# Altium project PCB_Control.PrjPcb
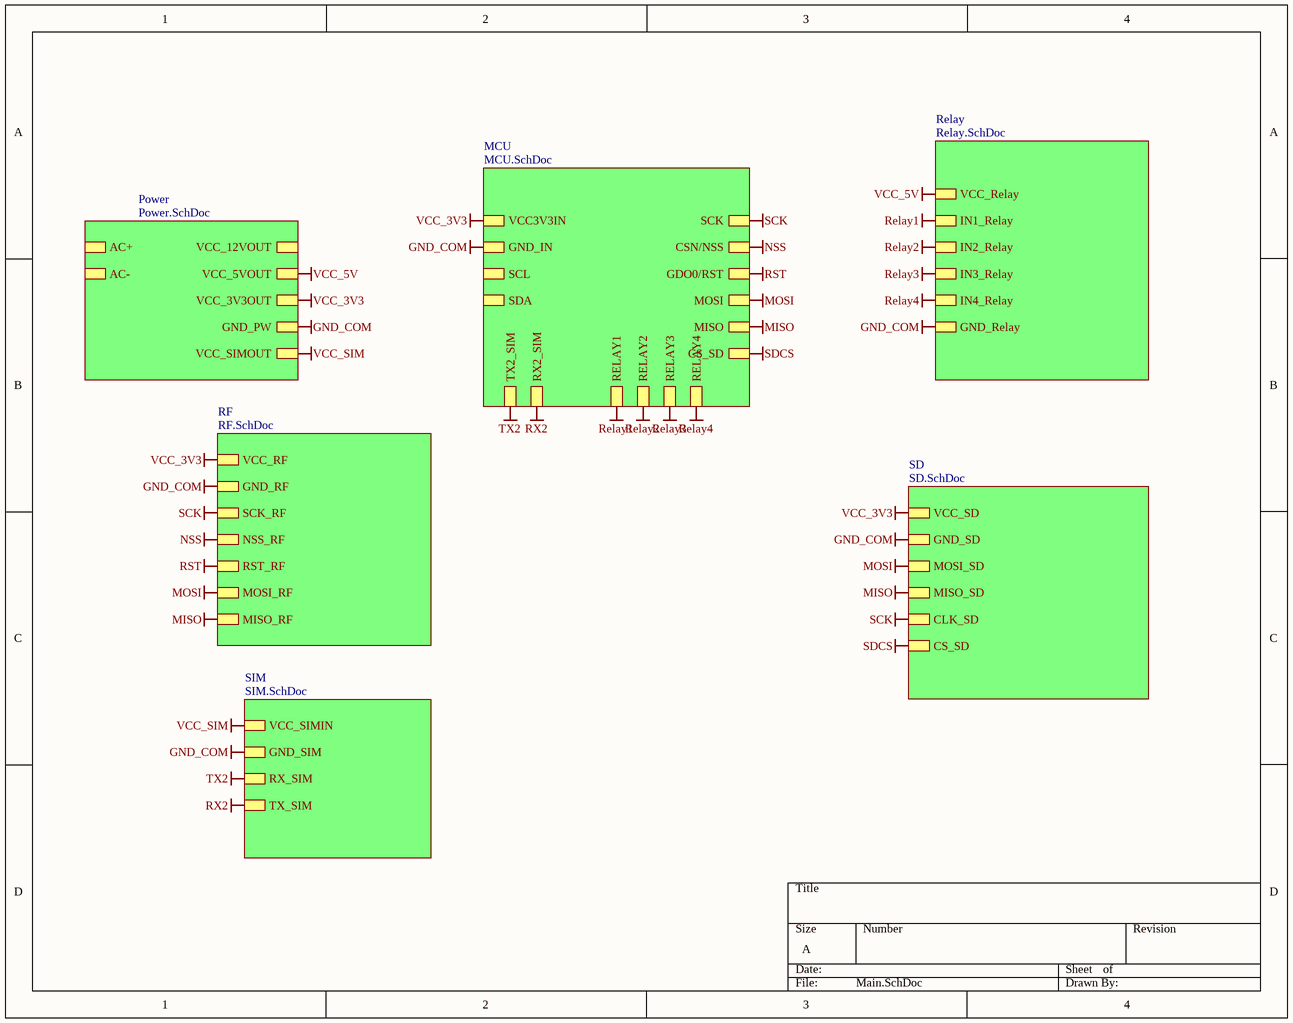
[diagram p0: Main.SchDoc]
7 sheets, 80 parts. Net scope: hierarchical (ports join the sheet entries above them; power ports are global).
Board files: Control.PcbDoc, PCB1.PcbDoc
Sheets:
  Main.SchDoc
    MCU = MCU.SchDoc
    Relay = Relay.SchDoc
    Power = Power.SchDoc
    SIM = SIM.SchDoc
    RF = RF.SchDoc
    SD = SD.SchDoc

## Sheet Main.SchDoc
size A; SheetNumber: 1; SheetTotal: 4

### Sub-sheets
MCU = MCU.SchDoc: TX2_SIM, RX2_SIM, SCK, CSN/NSS, GDO0/RST, MOSI, MISO, RELAY1, RELAY2, RELAY3, RELAY4, CS_SD, VCC3V3IN, GND_IN, SCL, SDA
Power = Power.SchDoc: VCC_12VOUT, VCC_5VOUT, VCC_3V3OUT, GND_PW, VCC_SIMOUT, AC+, AC-
Relay = Relay.SchDoc: VCC_Relay, IN1_Relay, IN2_Relay, IN3_Relay, IN4_Relay, GND_Relay
RF = RF.SchDoc: VCC_RF, GND_RF, SCK_RF, RST_RF, NSS_RF, MOSI_RF, MISO_RF
SD = SD.SchDoc: GND_SD, MOSI_SD, MISO_SD, CLK_SD, CS_SD, VCC_SD
SIM = SIM.SchDoc: VCC_SIMIN, GND_SIM, RX_SIM, TX_SIM

### Nets
GND_COM: sheet MCU/GND_IN, sheet Relay/GND_Relay, sheet Power/GND_PW, sheet SIM/GND_SIM, sheet RF/GND_RF, sheet SD/GND_SD  [project net GND]
MISO: sheet MCU/MISO, sheet RF/MISO_RF, sheet SD/MISO_SD
MOSI: sheet MCU/MOSI, sheet RF/MOSI_RF, sheet SD/MOSI_SD
NSS: sheet MCU/CSN/NSS, sheet RF/NSS_RF
Relay1: sheet MCU/RELAY1, sheet Relay/IN1_Relay  [project net IN1]
Relay2: sheet MCU/RELAY2, sheet Relay/IN2_Relay  [project net IN2]
Relay3: sheet MCU/RELAY3, sheet Relay/IN3_Relay  [project net IN3]
Relay4: sheet MCU/RELAY4, sheet Relay/IN4_Relay  [project net IN4]
RST: sheet MCU/GDO0/RST, sheet RF/RST_RF
RX2: sheet MCU/RX2_SIM, sheet SIM/TX_SIM
SCK: sheet MCU/SCK, sheet RF/SCK_RF, sheet SD/CLK_SD
SDCS: sheet MCU/CS_SD, sheet SD/CS_SD
TX2: sheet MCU/TX2_SIM, sheet SIM/RX_SIM
VCC_3V3: sheet MCU/VCC3V3IN, sheet Power/VCC_3V3OUT, sheet RF/VCC_RF, sheet SD/VCC_SD  [project net VCC_3V3PW]
VCC_5V: sheet Relay/VCC_Relay, sheet Power/VCC_5VOUT  [project net VCC]
VCC_SIM: sheet Power/VCC_SIMOUT, sheet SIM/VCC_SIMIN  [project net V_SIM_7V]

## Sheet MCU.SchDoc
size A; SheetNumber: 2; SheetTotal: 4
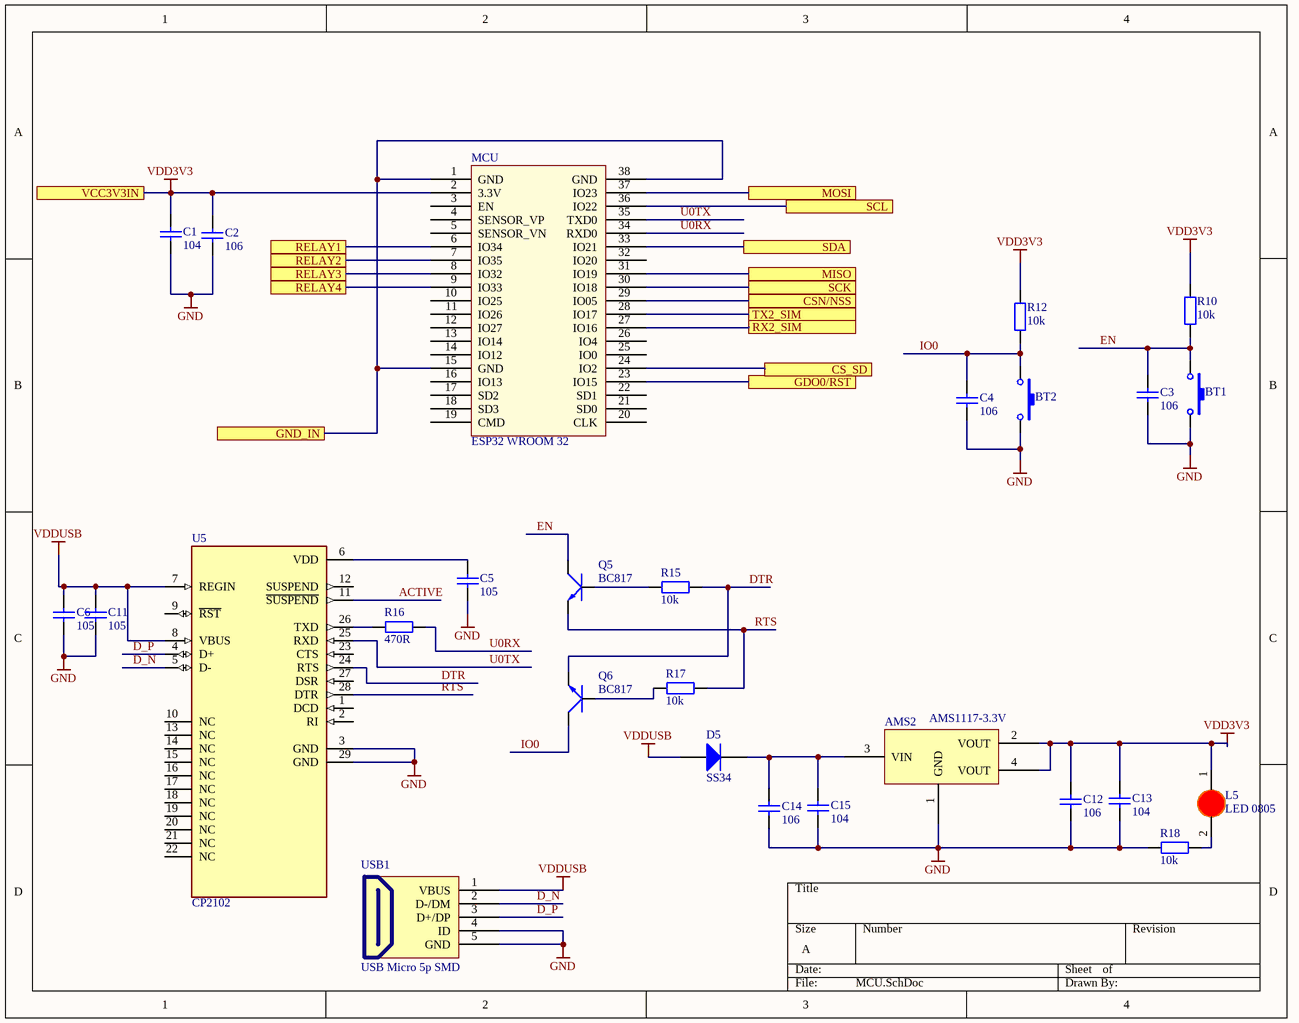
[diagram p1: MCU.SchDoc]

### Parts
AMS2  AMS1117-3.3V  [SOT223]
BT1  Nut Nhan 2 Chan SMD 3x6x2.5  [Nut Nhan 2 Chan SMD 3x6x2.5]  (value not drawn)
BT2  Nut Nhan 2 Chan SMD 3x6x2.5  [Nut Nhan 2 Chan SMD 3x6x2.5]  (value not drawn)
C1  104  [tu 0805]
C2  106  [tu 0805]
C3  106  [tu 0805]
C4  106  [tu 0805]
C5  105  [tu 0805]
C6  105  [tu 0805]
C11  105  [tu 0805]
C12  106  [tu 0805]
C13  104  [tu 0805]
C14  106  [tu 0805]
C15  104  [tu 0805]
D5  SS34  [DIODE SMA]
L5  LED 0805  [LED-0805-Red]
MCU  ESP32 WROOM 32  [ESP32-WROOM-32D]
Q5  BC817  [SOT-23]
Q6  BC817  [SOT-23]
R10  10k  [tro smd 0805]
R12  10k  [tro smd 0805]
R15  10k  [tro smd 0805]
R16  470R  [Tro SMD 0805]
R17  10k  [tro smd 0805]
R18  10k  [tro smd 0805]
U5  CP2102  [QFN50P500X500X100-29N]
USB1  USB Micro 5p SMD  [USB Micro 5p SMD]

### Ports
CS_SD, CSN/NSS, GDO0/RST, GND_IN, MISO, MOSI, RELAY1, RELAY2, RELAY3, RELAY4, RX2_SIM, SCK, SCL, SDA, TX2_SIM, VCC3V3IN

### Nets
GND: AMS2.1(GND) BT1.2 BT2.2 C1.2 C2.2 C3.2 C4.2 C5.2 C6.2 C11.2 C12.2 C13.2 C14.2 C15.2 MCU.1(GND) MCU.15(GND) MCU.38(GND) R18.2 U5.3(GND) U5.29(GND) USB1.4(ID) USB1.5(GND) ; port GND_IN
IN1: MCU.6(IO34) ; port RELAY1
IN2: MCU.7(IO35) ; port RELAY2
IN3: MCU.8(IO32) ; port RELAY3
IN4: MCU.9(IO33) ; port RELAY4
MISO: MCU.31(IO19) ; port MISO
MOSI: MCU.37(IO23) ; port MOSI
NSS: MCU.29(IO05) ; port CSN/NSS
RST: MCU.23(IO15) ; port GDO0/RST
RX2: MCU.27(IO16) ; port RX2_SIM
SCK: MCU.30(IO18) ; port SCK
SDCS: MCU.24(IO2) ; port CS_SD
TX2: MCU.28(IO17) ; port TX2_SIM
VDD3V3: AMS2.2(VOUT) AMS2.4(VOUT) C1.1 C2.1 C12.1 C13.1 L5.1(A) MCU.2(3.3V) R10.2 R12.2 ; port VCC3V3IN  [project net VCC_3V3PW]
VDDUSB: C6.1 C11.1 D5.1(A) U5.7(REGIN) U5.8(VBUS) USB1.1(VBUS)
ACTIVE: U5.11(~{SUSPEND})
D_N: U5.5(D-) USB1.2(D-/DM)
D_P: U5.4(D+) USB1.3(D+/DP)
DTR: Q6.2(E) R15.2 U5.24(RTS)
EN: BT1.1 C3.1 Q5.3(C) R10.1
IO0: BT2.1 C4.1 Q6.3(C) R12.1
RTS: Q5.2(E) R17.2 U5.28(DTR)
U0RX: MCU.34(RXD0) R16.2
U0TX: MCU.35(TXD0) U5.25(RXD)
NetAMS2_3: AMS2.3(VIN) C14.1 C15.1 D5.2(K)
NetC5_1: C5.1 U5.6(VDD)
NetL5_2: L5.2(K) R18.1
NetMCU_33: MCU.33(IO21) ; port SDA
NetMCU_36: MCU.36(IO22) ; port SCL
NetQ5_1: Q5.1(B) R15.1
NetQ6_1: Q6.1(B) R17.1
NetR16_1: R16.1 U5.26(TXD)

Not connected (* = marked no-connect by the designer): MCU 3(EN) 4(SENSOR_VP) 5(SENSOR_VN) 10(IO25) 11(IO26) 12(IO27) 13(IO14) 14(IO12) 16(IO13) 17(SD2) 18(SD3) 19(CMD) 20(CLK) 21(SD0) 22(SD1) 25(IO0) 26(IO4) 32(IO20); U5 1(DCD) 2(RI) 9(~{RST}) 10(NC) 12(SUSPEND) 13(NC) 14(NC) 15(NC) 16(NC) 17(NC) 18(NC) 19(NC) 20(NC) 21(NC) 22(NC) 23(CTS) 27(DSR)

### Library data of the parts
AMS2 = AMS1117 SMD: Dán; Value: AMS1117-3.3V SOT223; Don_Vi: Con; Ma_Hang: MH000596; Ghi_Chu: *; Kieu_Chan: *; Chung_Loai: Dán
BT1 BT2 = Nut Nhan 2 Chan SMD 3x6x2.5: Ma_Hang: MH001036; Ten: Nút Nhấn 2 Chân 3x6x2.5MM SMD
C1 C13 C15 = Tu 0805 104 50V 10%: Dán; Don_Vi: Con; So_Chan: 2; Ten_Linh_Kien: Tụ 0805 104-100nF 10% 50V; Ma_Hang: MH004551; Chung_Loai: Dán; Kieu_Chan: *
C2 = Tu 0805 106 16V 10%: Dán; Don_Vi: Con; So_Chan: 2; Ten_Linh_Kien: Tụ 0805 106-10uF 10% 16V; Ma_Hang: MH004553; Chung_Loai: Dán; Kieu_Chan: *
C3 C4 C12 C14 = Tu 0805 106 16V 10%: Dán; Ten_Linh_Kien: Tụ 0805 106-10uF 10% 16V; So_Chan: 2; Don_Vi: Con; Ma_Hang: MH004553; Chung_Loai: Dán; Kieu_Chan: *
C5 C6 C11 = Tu 0805 105 50V 10%: Dán; Don_Vi: Con; So_Chan: 2; Ten_Linh_Kien: Tụ 0805 105-1uF 10% 50V; Ma_Hang: MH004552; Chung_Loai: Dán; Kieu_Chan: *
D5 = Diode SS34 ( 1N5822 ): Dán; Don_Vi: Con; Ma_Hang: MH002104; Ten_Linh_Kien: Diode SS34 3A 40V SMA ( 1N5822 SS34A); Kieu_Chan: *; Chung_Loai: Dán
L5 = LED 0805 Do: Dán; Don_Vi: Con; Ma_Hang: MH000897; Ten_Linh_Kien: LED 0805 Màu Đỏ (Red); Ghi_Chu: *; Kieu_Chan: *; Chung_Loai: Dán
Q5 Q6 = Trans BC817: SOT-23 - C8658; Value: C9014
R10 R12 = Tro 0805 5% 10k: Dán; Don_Vi: Con; So_Chan: 2; Ten_Linh_Kien: Trở 0805 5% 10k; Ma_Hang: MH005239; Chung_Loai: Dán; Kieu_Chan: *
R15 R17 R18 = Tro 0805 1% 10k: Dán; Don_Vi: Con; So_Chan: 2; Ten_Linh_Kien: Trở 0805 1% 10k; Ma_Hang: MH005473; Chung_Loai: Dán; Kieu_Chan: *
R16 = Tro 0805 5% 470R: Dán; Don_Vi: Con; Ma_Hang: MH005341; Ten_Linh_Kien: Trở 0805 5% 470R; So_Chan: 2; Chung_Loai: Dán; Kieu_Chan: *
U5 = CP2102: CP2102N USB 2.0 to UART (RS232) Bridge Interface Evaluation Board; MF: Silicon Labs; Purchase-URL: https://pricing.snapeda.com/search/part/CP2102/?ref=eda; Package: WFQFN-20 Silicon Labs; Value: *; Check_prices: https://www.snapeda.com/parts/CP2102/Silicon+Labs/view-part/?ref=eda; SnapEDA_Link: https://www.snapeda.com/parts/CP2102/Silicon+Labs/view-part/?ref=snap; Availability: In Stock; Price: None; MP: CP2102
USB1 = USB Micro 5p SMD: USB Type B; Ten: MicroUSB MK5P SMD; Ma_Hang: MH001020

## Sheet Relay.SchDoc
size A; SheetNumber: 3; SheetTotal: 4
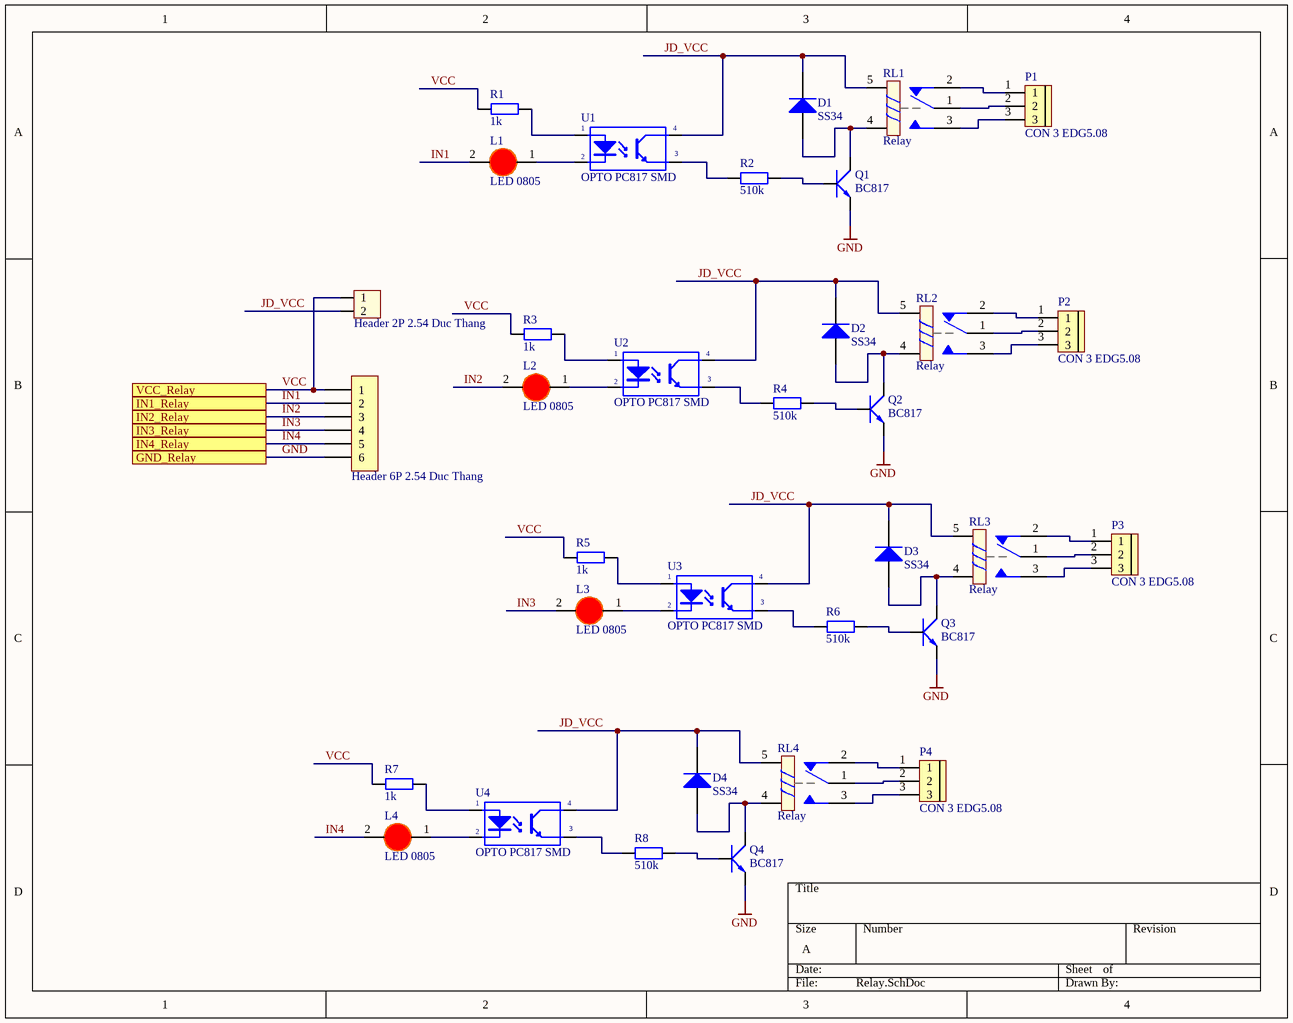
[diagram p2: Relay.SchDoc]

### Parts
D1  SS34  [DIODE SMA]
D2  SS34  [DIODE SMA]
D3  SS34  [DIODE SMA]
D4  SS34  [DIODE SMA]
H1  Header 2P 2.54 Duc Thang  [XH2.54M-2]
H2  Header 6P 2.54 Duc Thang  [XH2.54M-6]
L1  LED 0805  [LED-0805-Red]
L2  LED 0805  [LED-0805-Red]
L3  LED 0805  [LED-0805-Red]
L4  LED 0805  [LED-0805-Red]
P1  CON 3 EDG5.08  [CON 3 3EDG5.08]
P2  CON 3 EDG5.08  [CON 3 3EDG5.08]
P3  CON 3 EDG5.08  [CON 3 3EDG5.08]
P4  CON 3 EDG5.08  [CON 3 3EDG5.08]
Q1  BC817  [SOT-23]
Q2  BC817  [SOT-23]
Q3  BC817  [SOT-23]
Q4  BC817  [SOT-23]
R1  1k  [tro smd 0805]
R2  510k  [tro smd 0805]
R3  1k  [tro smd 0805]
R4  510k  [tro smd 0805]
R5  1k  [tro smd 0805]
R6  510k  [tro smd 0805]
R7  1k  [tro smd 0805]
R8  510k  [tro smd 0805]
RL1  Relay  [Relay 5 Chan SRD]
RL2  Relay  [Relay 5 Chan SRD]
RL3  Relay  [Relay 5 Chan SRD]
RL4  Relay  [Relay 5 Chan SRD]
U1  OPTO PC817 SMD  [SOP4]
U2  OPTO PC817 SMD  [SOP4]
U3  OPTO PC817 SMD  [SOP4]
U4  OPTO PC817 SMD  [SOP4]

### Ports
GND_Relay, IN1_Relay, IN2_Relay, IN3_Relay, IN4_Relay, VCC_Relay

### Nets
GND: H2.6 Q1.2(E) Q2.2(E) Q3.2(E) Q4.2(E) ; port GND_Relay
IN1: H2.2 L1.2(K) ; port IN1_Relay
IN2: H2.3 L2.2(K) ; port IN2_Relay
IN3: H2.4 L3.2(K) ; port IN3_Relay
IN4: H2.5 L4.2(K) ; port IN4_Relay
VCC: H1.1 H2.1 R1.2 R3.2 R5.2 R7.2 ; port VCC_Relay
JD_VCC: D1.2(K) D2.2(K) D3.2(K) D4.2(K) H1.2 RL1.5 RL2.5 RL3.5 RL4.5 U1.4(C) U2.4(C) U3.4(C) U4.4(C)
NetD1_1: D1.1(A) Q1.3(C) RL1.4
NetD2_1: D2.1(A) Q2.3(C) RL2.4
NetD3_1: D3.1(A) Q3.3(C) RL3.4
NetD4_1: D4.1(A) Q4.3(C) RL4.4
NetL1_1: L1.1(A) U1.2(K)
NetL2_1: L2.1(A) U2.2(K)
NetL3_1: L3.1(A) U3.2(K)
NetL4_1: L4.1(A) U4.2(K)
NetP1_1: P1.1 RL1.2
NetP1_2: P1.2 RL1.1
NetP1_3: P1.3 RL1.3
NetP2_1: P2.1 RL2.2
NetP2_2: P2.2 RL2.1
NetP2_3: P2.3 RL2.3
NetP3_1: P3.1 RL3.2
NetP3_2: P3.2 RL3.1
NetP3_3: P3.3 RL3.3
NetP4_1: P4.1 RL4.2
NetP4_2: P4.2 RL4.1
NetP4_3: P4.3 RL4.3
NetQ1_1: Q1.1(B) R2.2
NetQ2_1: Q2.1(B) R4.2
NetQ3_1: Q3.1(B) R6.2
NetQ4_1: Q4.1(B) R8.2
NetR1_1: R1.1 U1.1(A)
NetR2_1: R2.1 U1.3(E)
NetR3_1: R3.1 U2.1(A)
NetR4_1: R4.1 U2.3(E)
NetR5_1: R5.1 U3.1(A)
NetR6_1: R6.1 U3.3(E)
NetR7_1: R7.1 U4.1(A)
NetR8_1: R8.1 U4.3(E)

### Library data of the parts
D1-D4 = Diode SS34 ( 1N5822 ): as D5 on sheet MCU; Kieu_Chan: *; Chung_Loai: Dán
H1 = Header 2P 2.54 Duc Thang: Cắm; Ten_Linh_Kien: Header 2P XH2.54-2P Đực Thẳng; Don_Vi: Con; Ma_Hang: MH001283; Chung_Loai: Cắm
H2 = Header 6P 2.54 Duc Thang: Cắm; Ten_Linh_Kien: Header 6P XH2.54-6P Đực Thẳng; Don_Vi: Con; Ma_Hang: MH001972; Chung_Loai: Cắm
L1-L4 = LED 0805 Do: as L5 on sheet MCU; Ghi_Chu: *; Kieu_Chan: *; Chung_Loai: Dán
P1-P4 = CON 3 EDG5.08: Cắm; Ten_Linh_Kien: CON 3 2EDG5.08-3P 5.08MM ( Xanh Cong); Ma_Hang: MH000760; Ghi_Chu: *; Kieu_Chan: *; Don_Vi: Con; Chung_Loai: Cắm
Q1-Q4 = Trans BC817: SOT-23 - C8658; Value: C9014
R1 R3 R5 R7 = Tro 0805 1% 1k: Dán; Don_Vi: Con; So_Chan: 2; Ten_Linh_Kien: Trở 0805 1% 1k; Ma_Hang: MH005468; Chung_Loai: Dán; Kieu_Chan: *
R2 R4 R6 R8 = Tro 0805 1% 510k: Dán; Don_Vi: Con; So_Chan: 2; Ten_Linh_Kien: Trở 0805 1% 510k; Ma_Hang: MH005486; Chung_Loai: Dán; Kieu_Chan: *
RL1-RL4 = Relay 5 Chan SRD: Relay 5 Chan; Ma_Hang: MH009374; Ten: Relay 5V10A SRD-05VDC-SL-C Chính Hãng
U1-U4 = OPTO PC817 SMD: Single Opto; Value: PC817

## Sheet Power.SchDoc
size A
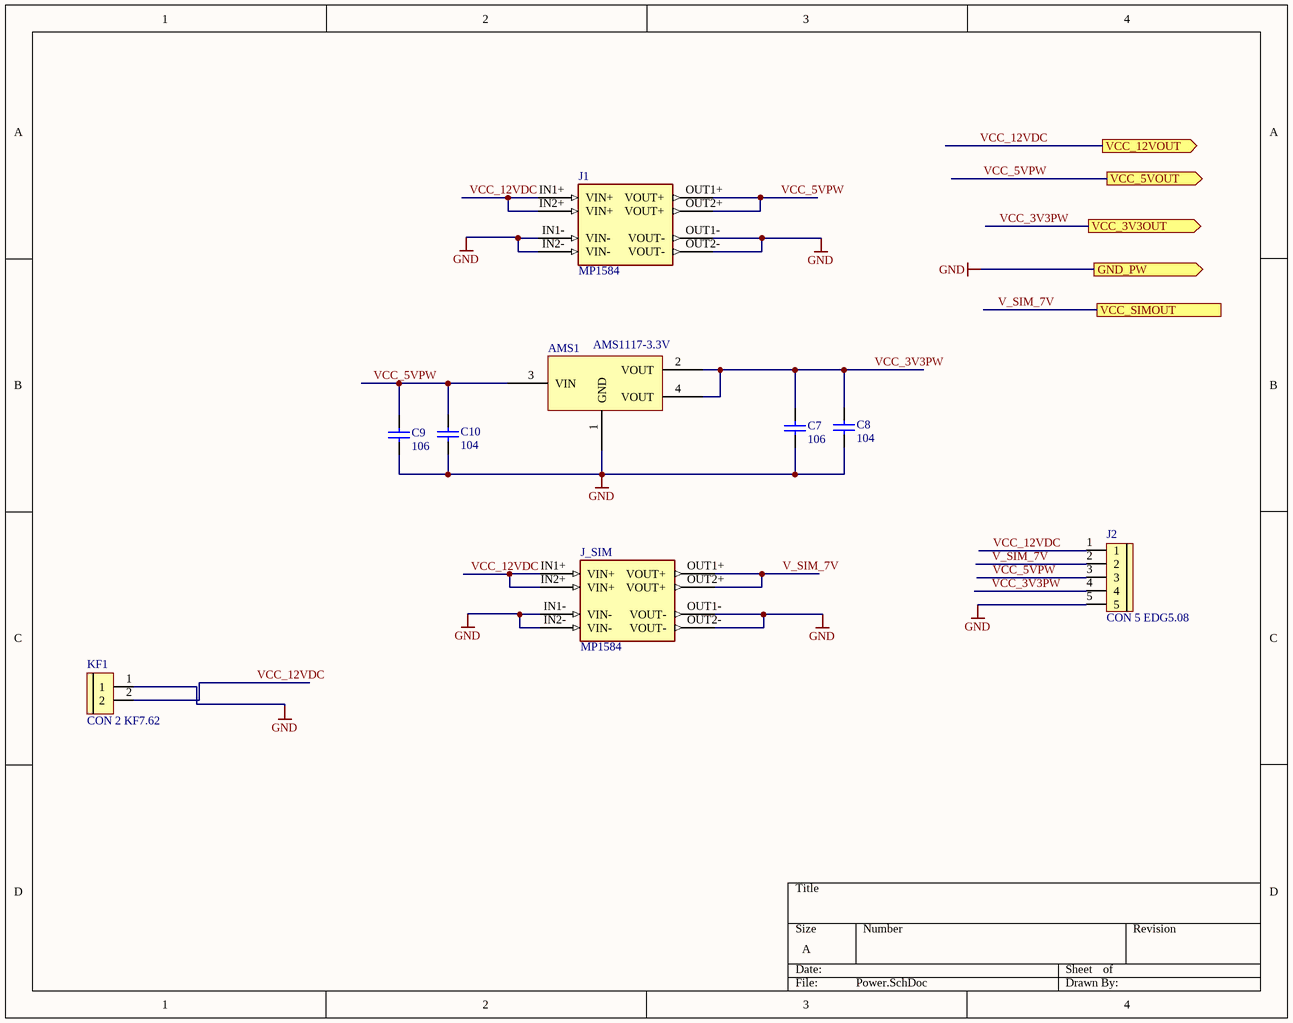
[diagram p3: Power.SchDoc]

### Parts
AMS1  AMS1117-3.3V  [SOT223]
C7  106  [tu 0805]
C8  104  [tu 0805]
C9  106  [tu 0805]
C10  104  [tu 0805]
J1  MP1584  [DC-BRICK]
J2  CON 5 EDG5.08  [CON 5 5EDG5.08]
J_SIM  MP1584  [DC-BRICK]
KF1  CON 2 KF7.62  [CON 2 KF7.62]

### Ports
GND_PW (out), VCC_3V3OUT (out), VCC_5VOUT (out), VCC_12VOUT (out), VCC_SIMOUT

### Nets
GND: AMS1.1(GND) C7.2 C8.2 C9.2 C10.2 J1.IN1-(VIN-) J1.IN2-(VIN-) J1.OUT1-(VOUT-) J1.OUT2-(VOUT-) J2.5 J_SIM.IN1-(VIN-) J_SIM.IN2-(VIN-) J_SIM.OUT1-(VOUT-) J_SIM.OUT2-(VOUT-) KF1.1 ; port GND_PW
V_SIM_7V: J2.2 J_SIM.OUT1+(VOUT+) J_SIM.OUT2+(VOUT+) ; port VCC_SIMOUT
VCC_3V3PW: AMS1.2(VOUT) AMS1.4(VOUT) C7.1 C8.1 J2.4 ; port VCC_3V3OUT
VCC_5VPW: AMS1.3(VIN) C9.1 C10.1 J1.OUT1+(VOUT+) J1.OUT2+(VOUT+) J2.3 ; port VCC_5VOUT  [project net VCC]
VCC_12VDC: J1.IN1+(VIN+) J1.IN2+(VIN+) J2.1 J_SIM.IN1+(VIN+) J_SIM.IN2+(VIN+) KF1.2 ; port VCC_12VOUT

### Library data of the parts
AMS1 = AMS1117 SMD: as AMS2 on sheet MCU; Ghi_Chu: *; Kieu_Chan: *; Chung_Loai: Dán
C7 C9 = Tu 0805 106 16V 10%: as C3 on sheet MCU; Chung_Loai: Dán; Kieu_Chan: *
C8 C10 = Tu 0805 104 50V 10%: as C1 on sheet MCU; Chung_Loai: Dán; Kieu_Chan: *
J1 J_SIM = MP1584: Buck Switching Regulator IC Positive Adjustable 0.8V 1 Output 3A 8-SOIC (0.154, 3.90mm Width) Exposed Pad; MF: Monolithic Power; SnapEDA_Link: https://www.snapeda.com/parts/MP1584/Monolithic+Power+Systems+Inc./view-part/?ref=snap; Package: SOIC-8 Monolithic Power; Value: *; MP: MP1584; Check_prices: https://www.snapeda.com/parts/MP1584/Monolithic+Power+Systems+Inc./view-part/?ref=eda
J2 = CON 5 EDG5.08: Cắm; Ten_Linh_Kien: CON 5 2EDG5.08-5P 5.08MM ( Xanh Cong); Ma_Hang: MH003589; Kieu_Chan: *; Don_Vi: Con; Ghi_Chu: *; Chung_Loai: Cắm
KF1 = CON 2 KF7.62: Cắm; Ma_Hang: MH002053; Ten_Linh_Kien: CON 2 KF7.62-2P 7.62MM (Đen Thẳng); Chung_Loai: Cắm; Ghi_Chu: *; Kieu_Chan: *; Don_Vi: Con

## Sheet SIM.SchDoc
size A
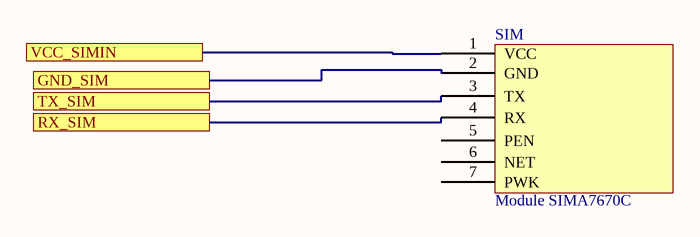
[diagram p4: SIM.SchDoc]

### Parts
SIM  Module SIMA7670C  [Module sim7670C]

### Ports
GND_SIM, RX_SIM, TX_SIM, VCC_SIMIN

### Nets
GND: SIM.2(GND) ; port GND_SIM
RX2: SIM.3(TX) ; port TX_SIM
TX2: SIM.4(RX) ; port RX_SIM
V_SIM_7V: SIM.1(VCC) ; port VCC_SIMIN

Not connected (* = marked no-connect by the designer): SIM 5(PEN) 6(NET) 7(PWK)

## Sheet RF.SchDoc
size A
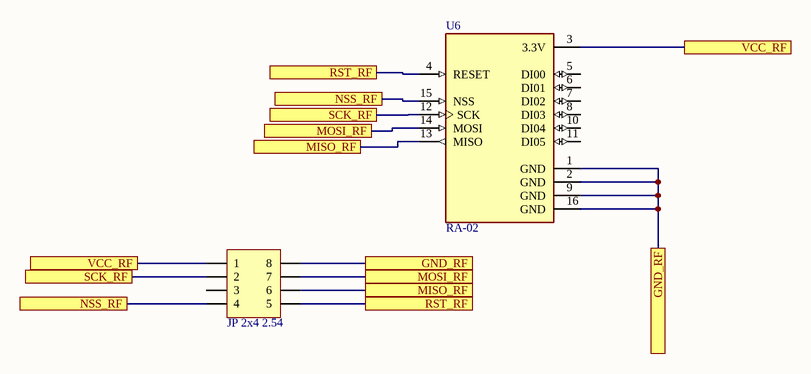
[diagram p5: RF.SchDoc]

### Parts
JP1  JP 2x4 2.54  [JP 2x4 CT]
U6  RA-02  [RA-02]

### Ports
GND_RF, MISO_RF, MOSI_RF, NSS_RF, RST_RF, SCK_RF, VCC_RF

### Nets
GND: JP1.8 U6.1(GND) U6.2(GND) U6.9(GND) U6.16(GND) ; port GND_RF
MISO: JP1.6 U6.13(MISO) ; port MISO_RF
MOSI: JP1.7 U6.14(MOSI) ; port MOSI_RF
NSS: JP1.4 U6.15(NSS) ; port NSS_RF
RST: JP1.5 U6.4(RESET) ; port RST_RF
SCK: JP1.2 U6.12(SCK) ; port SCK_RF
VCC_3V3PW: JP1.1 U6.3(3.3V) ; port VCC_RF

Not connected (* = marked no-connect by the designer): JP1 3; U6 5(DI00) 6(DI01) 7(DI02) 8(DI03) 10(DI04) 11(DI05)

### Library data of the parts
JP1 = JP 2x4 2.54 Cai Thang: Cắm; Ten_Linh_Kien: Jump Đôi Cái 2.54MM 2x20P Thẳng; Don_Vi: Con; Ma_Hang: MH008647; Ghi_Chu: *; Kieu_Chan: *; Chung_Loai: Cắm
U6 = RA-02: General ISM < 1GHz LoRaâ„¢ Transceiver Module 410MHz ~ 525MHz Antenna Not Included, I-PEX Surface Mount; MF: Ai-Thinker; Package: None; Price: None; Value: *; SnapEDA_Link: https://www.snapeda.com/parts/RA-02/AI-Thinker/view-part/?ref=snap; MP: RA-02; Availability: Not in stock; Check_prices: https://www.snapeda.com/parts/RA-02/AI-Thinker/view-part/?ref=eda

## Sheet SD.SchDoc
size A
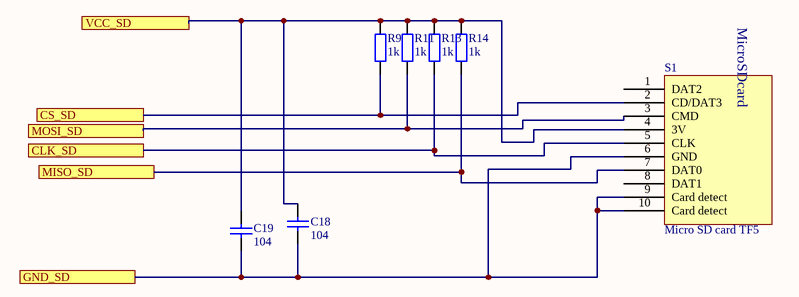
[diagram p6: SD.SchDoc]

### Parts
C18  104  [tu 0805]
C19  104  [tu 0805]
R9  1k  [tro smd 0805]
R11  1k  [tro smd 0805]
R13  1k  [tro smd 0805]
R14  1k  [tro smd 0805]
S1  Micro SD card TF5  [MicroSD TF V5]

### Ports
CLK_SD, CS_SD, GND_SD, MISO_SD, MOSI_SD, VCC_SD

### Nets
GND: C18.2 C19.2 S1.6(GND) S1.9(Card_detect) S1.10(Card_detect) ; port GND_SD
MISO: R14.1 S1.7(DAT0) ; port MISO_SD
MOSI: R11.1 S1.3(CMD) ; port MOSI_SD
SCK: R13.1 S1.5(CLK) ; port CLK_SD
SDCS: R9.2 S1.2(CD/DAT3) ; port CS_SD
VCC_3V3PW: C18.1 C19.1 R9.1 R11.2 R13.2 R14.2 S1.4(3V) ; port VCC_SD

Not connected (* = marked no-connect by the designer): S1 1(DAT2) 8(DAT1)

### Notes on the sheet
- (in symbol Micro SD card TF5) MicroSDcard

### Library data of the parts
C18 C19 = Tu 0805 104 50V 10%: as C1 on sheet MCU; Chung_Loai: Dán; Kieu_Chan: *
R9 R11 R13 R14 = Tro 0805 1% 1k: as R1 on sheet Relay; Chung_Loai: Dán; Kieu_Chan: *

## Nets that join several sheets
GND: MCU (22 pins), Relay (5 pins), Power (15 pins), SIM (SIM.2), RF (5 pins), SD (5 pins)
IN1: MCU (MCU.6), Relay (H2.2 L1.2)
IN2: MCU (MCU.7), Relay (H2.3 L2.2)
IN3: MCU (MCU.8), Relay (H2.4 L3.2)
IN4: MCU (MCU.9), Relay (H2.5 L4.2)
MISO: MCU (MCU.31), RF (JP1.6 U6.13), SD (R14.1 S1.7)
MOSI: MCU (MCU.37), RF (JP1.7 U6.14), SD (R11.1 S1.3)
NSS: MCU (MCU.29), RF (JP1.4 U6.15)
RST: MCU (MCU.23), RF (JP1.5 U6.4)
RX2: MCU (MCU.27), SIM (SIM.3)
SCK: MCU (MCU.30), RF (JP1.2 U6.12), SD (R13.1 S1.5)
SDCS: MCU (MCU.24), SD (R9.2 S1.2)
TX2: MCU (MCU.28), SIM (SIM.4)
V_SIM_7V: Power (J2.2 J_SIM.OUT1+ J_SIM.OUT2+), SIM (SIM.1)
VCC: Relay (6 pins), Power (6 pins)
VCC_3V3PW: MCU (10 pins), Power (5 pins), RF (JP1.1 U6.3), SD (7 pins)